# EAGLE schematic multiplex (EAGLE 7.4.0)
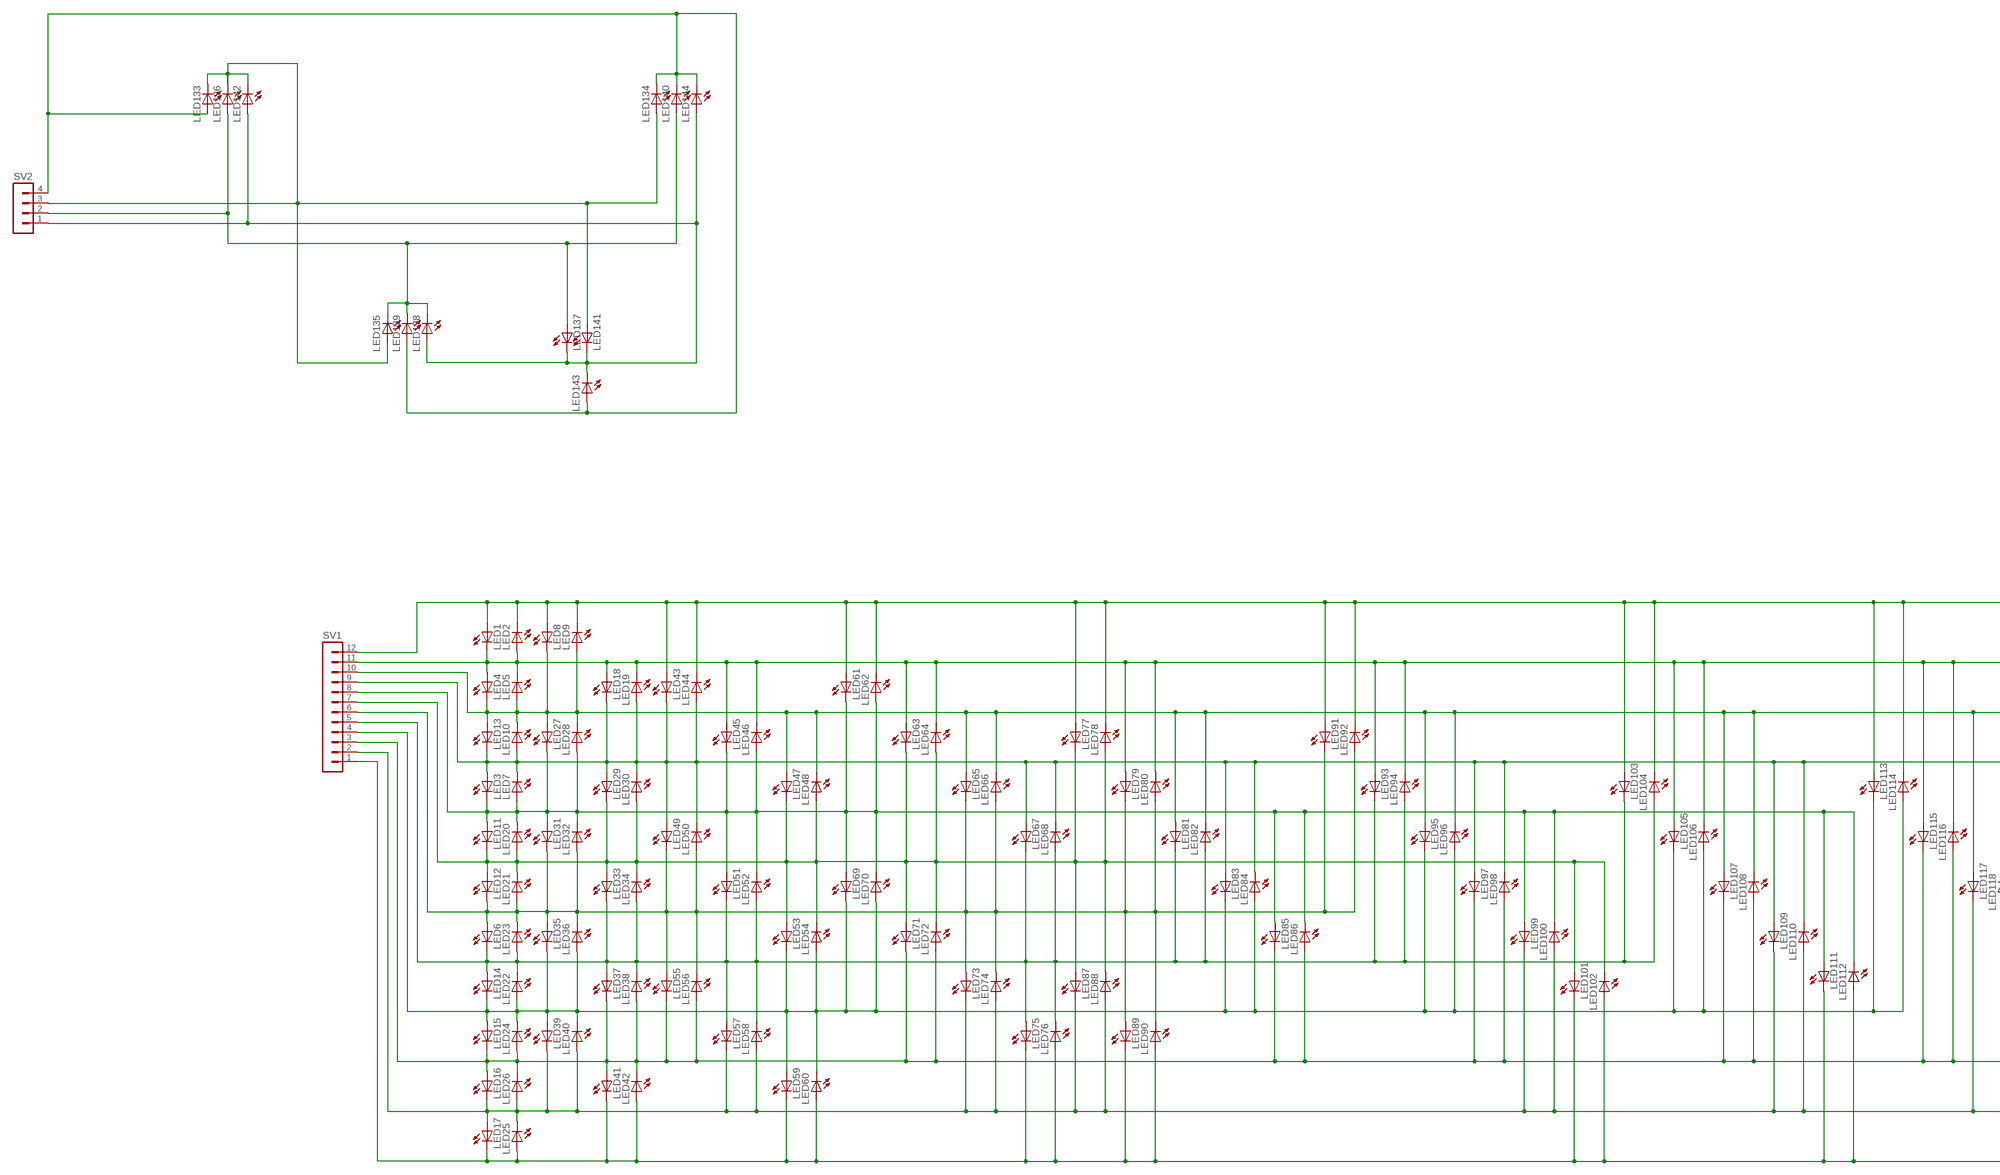
[diagram p0: schematic, sheet 1, part 1 of 2]
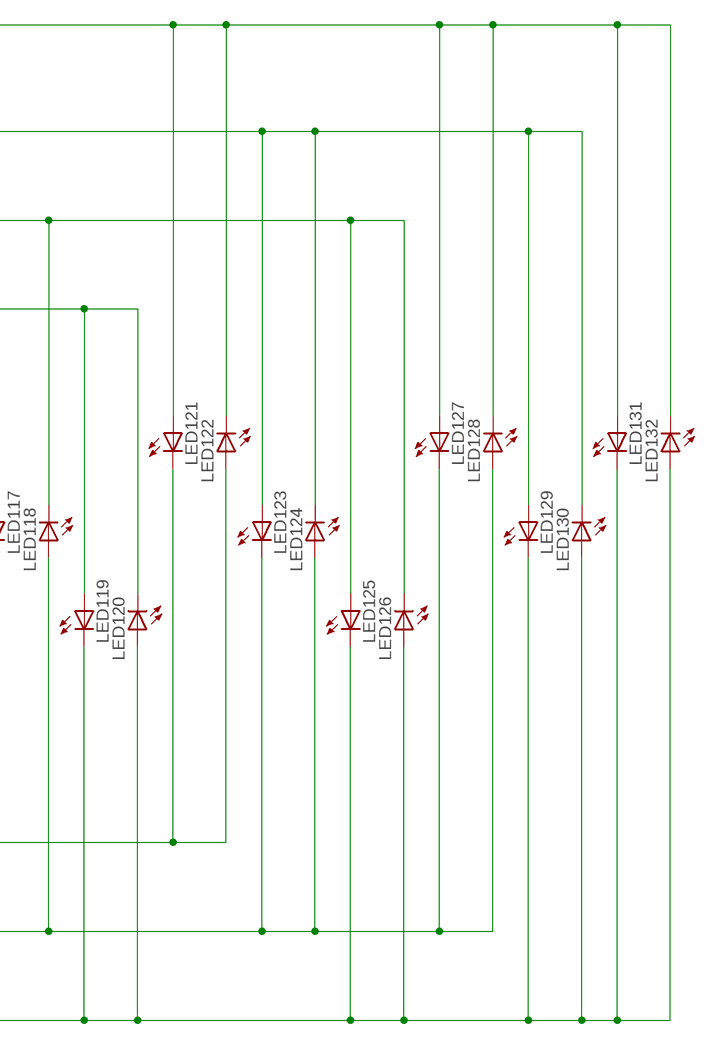
[diagram p1: schematic, sheet 1, part 2 of 2]

## Parts
LED1  LED5MM  [LED5MM]
LED2  LED5MM  [LED5MM]
LED3  LED5MM  [LED5MM]
LED4  LED5MM  [LED5MM]
LED5  LED5MM  [LED5MM]
LED6  LED5MM  [LED5MM]
LED7  LED5MM  [LED5MM]
LED8  LED5MM  [LED5MM]
LED9  LED5MM  [LED5MM]
LED10  LED5MM  [LED5MM]
LED11  LED5MM  [LED5MM]
LED12  LED5MM  [LED5MM]
LED13  LED5MM  [LED5MM]
LED14  LED5MM  [LED5MM]
LED15  LED5MM  [LED5MM]
LED16  LED5MM  [LED5MM]
LED17  LED5MM  [LED5MM]
LED18  LED5MM  [LED5MM]
LED19  LED5MM  [LED5MM]
LED20  LED5MM  [LED5MM]
LED21  LED5MM  [LED5MM]
LED22  LED5MM  [LED5MM]
LED23  LED5MM  [LED5MM]
LED24  LED5MM  [LED5MM]
LED25  LED5MM  [LED5MM]
LED26  LED5MM  [LED5MM]
LED27  LED5MM  [LED5MM]
LED28  LED5MM  [LED5MM]
LED29  LED5MM  [LED5MM]
LED30  LED5MM  [LED5MM]
LED31  LED5MM  [LED5MM]
LED32  LED5MM  [LED5MM]
LED33  LED5MM  [LED5MM]
LED34  LED5MM  [LED5MM]
LED35  LED5MM  [LED5MM]
LED36  LED5MM  [LED5MM]
LED37  LED5MM  [LED5MM]
LED38  LED5MM  [LED5MM]
LED39  LED5MM  [LED5MM]
LED40  LED5MM  [LED5MM]
LED41  LED5MM  [LED5MM]
LED42  LED5MM  [LED5MM]
LED43  LED5MM  [LED5MM]
LED44  LED5MM  [LED5MM]
LED45  LED5MM  [LED5MM]
LED46  LED5MM  [LED5MM]
LED47  LED5MM  [LED5MM]
LED48  LED5MM  [LED5MM]
LED49  LED5MM  [LED5MM]
LED50  LED5MM  [LED5MM]
LED51  LED5MM  [LED5MM]
LED52  LED5MM  [LED5MM]
LED53  LED5MM  [LED5MM]
LED54  LED5MM  [LED5MM]
LED55  LED5MM  [LED5MM]
LED56  LED5MM  [LED5MM]
LED57  LED5MM  [LED5MM]
LED58  LED5MM  [LED5MM]
LED59  LED5MM  [LED5MM]
LED60  LED5MM  [LED5MM]
LED61  LED5MM  [LED5MM]
LED62  LED5MM  [LED5MM]
LED63  LED5MM  [LED5MM]
LED64  LED5MM  [LED5MM]
LED65  LED5MM  [LED5MM]
LED66  LED5MM  [LED5MM]
LED67  LED5MM  [LED5MM]
LED68  LED5MM  [LED5MM]
LED69  LED5MM  [LED5MM]
LED70  LED5MM  [LED5MM]
LED71  LED5MM  [LED5MM]
LED72  LED5MM  [LED5MM]
LED73  LED5MM  [LED5MM]
LED74  LED5MM  [LED5MM]
LED75  LED5MM  [LED5MM]
LED76  LED5MM  [LED5MM]
LED77  LED5MM  [LED5MM]
LED78  LED5MM  [LED5MM]
LED79  LED5MM  [LED5MM]
LED80  LED5MM  [LED5MM]
LED81  LED5MM  [LED5MM]
LED82  LED5MM  [LED5MM]
LED83  LED5MM  [LED5MM]
LED84  LED5MM  [LED5MM]
LED85  LED5MM  [LED5MM]
LED86  LED5MM  [LED5MM]
LED87  LED5MM  [LED5MM]
LED88  LED5MM  [LED5MM]
LED89  LED5MM  [LED5MM]
LED90  LED5MM  [LED5MM]
LED91  LED5MM  [LED5MM]
LED92  LED5MM  [LED5MM]
LED93  LED5MM  [LED5MM]
LED94  LED5MM  [LED5MM]
LED95  LED5MM  [LED5MM]
LED96  LED5MM  [LED5MM]
LED97  LED5MM  [LED5MM]
LED98  LED5MM  [LED5MM]
LED99  LED5MM  [LED5MM]
LED100  LED5MM  [LED5MM]
LED101  LED5MM  [LED5MM]
LED102  LED5MM  [LED5MM]
LED103  LED5MM  [LED5MM]
LED104  LED5MM  [LED5MM]
LED105  LED5MM  [LED5MM]
LED106  LED5MM  [LED5MM]
LED107  LED5MM  [LED5MM]
LED108  LED5MM  [LED5MM]
LED109  LED5MM  [LED5MM]
LED110  LED5MM  [LED5MM]
LED111  LED5MM  [LED5MM]
LED112  LED5MM  [LED5MM]
LED113  LED5MM  [LED5MM]
LED114  LED5MM  [LED5MM]
LED115  LED5MM  [LED5MM]
LED116  LED5MM  [LED5MM]
LED117  LED5MM  [LED5MM]
LED118  LED5MM  [LED5MM]
LED119  LED5MM  [LED5MM]
LED120  LED5MM  [LED5MM]
LED121  LED5MM  [LED5MM]
LED122  LED5MM  [LED5MM]
LED123  LED5MM  [LED5MM]
LED124  LED5MM  [LED5MM]
LED125  LED5MM  [LED5MM]
LED126  LED5MM  [LED5MM]
LED127  LED5MM  [LED5MM]
LED128  LED5MM  [LED5MM]
LED129  LED5MM  [LED5MM]
LED130  LED5MM  [LED5MM]
LED131  LED5MM  [LED5MM]
LED132  LED5MM  [LED5MM]
LED133  LED5MM  [LED5MM]
LED134  LED5MM  [LED5MM]
LED135  LED5MM  [LED5MM]
LED136  LED5MM  [LED5MM]
LED137  LED5MM  [LED5MM]
LED138  LED5MM  [LED5MM]
LED139  LED5MM  [LED5MM]
LED140  LED5MM  [LED5MM]
LED141  LED5MM  [LED5MM]
LED142  LED5MM  [LED5MM]
LED143  LED5MM  [LED5MM]
LED144  LED5MM  [LED5MM]
SV1  MA12-1  [MA12-1]
SV2  MA04-1  [MA04-1]

## Nets
N$1: LED3.K(C) LED7.A LED11.A LED20.K(C) LED27.K(C) LED28.A LED31.A LED32.K(C) LED45.K(C) LED46.A LED51.A LED52.K(C) LED61.K(C) LED62.A LED69.A LED70.K(C) LED85.A LED86.K(C) LED99.A LED100.K(C) LED111.A LED112.K(C) SV1.8
N$2: LED6.A LED12.K(C) LED21.A LED23.K(C) LED31.K(C) LED32.A LED35.A LED36.K(C) LED49.K(C) LED50.A LED55.A LED56.K(C) LED65.K(C) LED66.A LED73.A LED74.K(C) LED79.K(C) LED80.A LED89.A LED90.K(C) LED91.K(C) LED92.A SV1.6
N$3: LED1.A LED2.K(C) LED8.A LED9.K(C) LED43.A LED44.K(C) LED61.A LED62.K(C) LED77.A LED78.K(C) LED91.A LED92.K(C) LED103.A LED104.K(C) LED113.A LED114.K(C) LED121.A LED122.K(C) LED127.A LED128.K(C) LED131.A LED132.K(C) SV1.12
N$4: LED133.K(C) LED134.A LED135.A LED136.K(C) LED141.A LED142.K(C) SV2.3
N$6: LED135.K(C) LED136.A LED137.A LED138.K(C) LED139.K(C) LED140.A SV2.2
N$8: LED1.K(C) LED2.A LED4.A LED5.K(C) LED18.A LED19.K(C) LED45.A LED46.K(C) LED63.A LED64.K(C) LED79.A LED80.K(C) LED93.A LED94.K(C) LED105.A LED106.K(C) LED115.A LED116.K(C) LED123.A LED124.K(C) LED129.A LED130.K(C) SV1.11
N$9: LED4.K(C) LED5.A LED8.K(C) LED9.A LED10.K(C) LED13.A LED27.A LED28.K(C) LED47.A LED48.K(C) LED65.A LED66.K(C) LED81.A LED82.K(C) LED95.A LED96.K(C) LED107.A LED108.K(C) LED117.A LED118.K(C) LED125.A LED126.K(C) SV1.10
N$10: LED3.A LED7.K(C) LED10.A LED13.K(C) LED18.K(C) LED19.A LED29.A LED30.K(C) LED43.K(C) LED44.A LED49.A LED50.K(C) LED67.A LED68.K(C) LED83.A LED84.K(C) LED97.A LED98.K(C) LED109.A LED110.K(C) LED119.A LED120.K(C) SV1.9
N$11: LED133.A LED134.K(C) LED139.A LED140.K(C) LED143.A LED144.K(C) SV2.4
N$12: LED11.K(C) LED12.A LED20.A LED21.K(C) LED29.K(C) LED30.A LED33.A LED34.K(C) LED47.K(C) LED48.A LED53.A LED54.K(C) LED63.K(C) LED64.A LED71.A LED72.K(C) LED77.K(C) LED78.A LED87.A LED88.K(C) LED101.A LED102.K(C) SV1.7
N$14: LED6.K(C) LED14.A LED22.K(C) LED23.A LED33.K(C) LED34.A LED37.A LED38.K(C) LED51.K(C) LED52.A LED57.A LED58.K(C) LED67.K(C) LED68.A LED75.A LED76.K(C) LED81.K(C) LED82.A LED93.K(C) LED94.A LED103.K(C) LED104.A SV1.5
N$16: LED14.K(C) LED15.A LED22.A LED24.K(C) LED35.K(C) LED36.A LED39.A LED40.K(C) LED53.K(C) LED54.A LED59.A LED60.K(C) LED69.K(C) LED70.A LED83.K(C) LED84.A LED95.K(C) LED96.A LED105.K(C) LED106.A LED113.K(C) LED114.A SV1.4
N$17: LED15.K(C) LED16.A LED24.A LED26.K(C) LED37.K(C) LED38.A LED41.A LED42.K(C) LED55.K(C) LED56.A LED71.K(C) LED72.A LED85.K(C) LED86.A LED97.K(C) LED98.A LED107.K(C) LED108.A LED115.K(C) LED116.A LED121.K(C) LED122.A SV1.3
N$18: LED137.K(C) LED138.A LED141.K(C) LED142.A LED143.K(C) LED144.A SV2.1
N$19: LED16.K(C) LED17.A LED25.K(C) LED26.A LED39.K(C) LED40.A LED57.K(C) LED58.A LED73.K(C) LED74.A LED87.K(C) LED88.A LED99.K(C) LED100.A LED109.K(C) LED110.A LED117.K(C) LED118.A LED123.K(C) LED124.A LED127.K(C) LED128.A SV1.2
N$21: LED17.K(C) LED25.A LED41.K(C) LED42.A LED59.K(C) LED60.A LED75.K(C) LED76.A LED89.K(C) LED90.A LED101.K(C) LED102.A LED111.K(C) LED112.A LED119.K(C) LED120.A LED125.K(C) LED126.A LED129.K(C) LED130.A LED131.K(C) LED132.A SV1.1

## Library data of the parts
LED1-LED144 = led:LED: LED OSRAM: - CHIPLED LG R971, LG N971, LY N971, LG Q971, LY Q971, LO R971, LY R971 LH N974, LH R974 LS Q976, LO Q976, LY Q976 LO Q996 - Hyper CHIPLED LW Q18S LB Q993, LB Q99A, LB R99A - SideLED LS A670, LO A670, LY A670, LG A670, LP A670 LB A673, LV A673, LT A673, LW A673 LH A674 LY A675 LS A676, LA A676, LO A676, LY A676, LW A676 LS A679, LY A679, LG A679 - Hyper Micro SIDELED® LS Y876, LA Y876, LO Y876, LY Y876 LT Y87S - SmartLED LW L88C, LW L88S LB L89C, LB L89S, LG L890 LS L89K, LO L89K, LY L89K LS L896, LA L896, LO L896, LY L896 - TOPLED LS T670, LO T670, LY T670, LG T670, LP T670 LSG T670, LSP T670, LSY T670, LOP T670, LYG T670 LG T671, LOG T671, LSG T671 LB T673, LV T673, LT T673, LW T673 LH T674 LS T676, LA T676, LO T676, LY T676, LB T676, LH T676, LSB T676, LW T676 LB T67C, LV T67C, LT T67C, LS T67K, LO T67K, LY T67K, LW E67C LS E67B, LA E67B, LO E67B, LY E67B, LB E67C, LV E67C, LT E67C LW T67C LS T679, LY T679, LG T679 LS T770, LO T770, LY T770, LG T770, LP T770 LB T773, LV T773, LT T773, LW T773 LH T774 LS E675, LA E675, LY E675, LS T675 LS T776, LA T776, LO T776, LY T776, LB T776 LHGB T686 LT T68C, LB T68C - Hyper Mini TOPLED® LB M676 - Mini TOPLED Santana® LG M470 LS M47K, LO M47K, LY M47K Source: http://www.osram.convergy.de LUXEON: - LUMILED® LXK2-PW12-R00, LXK2-PW12-S00, LXK2-PW14-U00, LXK2-PW14-V00 LXK2-PM12-R00, LXK2-PM12-S00, LXK2-PM14-U00 LXK2-PE12-Q00, LXK2-PE12-R00, LXK2-PE12-S00, LXK2-PE14-T00, LXK2-PE14-U00 LXK2-PB12-K00, LXK2-PB12-L00, LXK2-PB12-M00, LXK2-PB14-N00, LXK2-PB14-P00, LXK2-PB14-Q00 LXK2-PR12-L00, LXK2-PR12-M00, LXK2-PR14-Q00, LXK2-PR14-R00 LXK2-PD12-Q00, LXK2-PD12-R00, LXK2-PD12-S00 LXK2-PH12-R00, LXK2-PH12-S00 LXK2-PL12-P00, LXK2-PL12-Q00, LXK2-PL12-R00 Source: www.luxeon.com KINGBRIGHT: KA-3528ASYC Source: www.kingbright.com
SV1 = con-lstb:MA12-1: PIN HEADER; OC_FARNELL: unknown; OC_NEWARK: unknown
SV2 = con-lstb:MA04-1: PIN HEADER; OC_FARNELL: unknown; OC_NEWARK: unknown